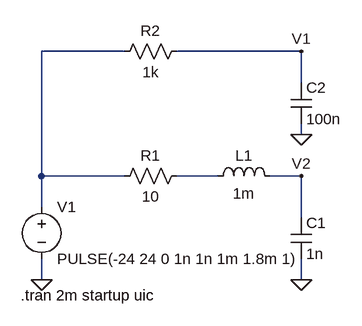
[diagram p0: schematic ex1_rc_rlc.asc]
ex1_rc_rlc.asc, the LTspice schematic file:
Version 4
SHEET 1 880 680
WIRE 80 -64 -48 -64
WIRE 352 -64 160 -64
WIRE 352 -16 352 -64
WIRE 352 64 352 48
WIRE -48 128 -48 -64
WIRE 80 128 -48 128
WIRE 224 128 160 128
WIRE 352 128 304 128
WIRE -48 176 -48 128
WIRE 352 192 352 128
WIRE -48 288 -48 256
WIRE 352 288 352 256
FLAG 352 288 0
FLAG -48 288 0
FLAG 352 64 0
FLAG 352 -64 V1
FLAG 352 128 V2
SYMBOL res 176 112 R90
WINDOW 0 0 56 VBottom 2
WINDOW 3 32 56 VTop 2
SYMATTR InstName R1
SYMATTR Value 10
SYMBOL ind 208 144 R270
WINDOW 0 32 56 VTop 2
WINDOW 3 5 56 VBottom 2
SYMATTR InstName L1
SYMATTR Value 1m
SYMBOL cap 336 192 R0
SYMATTR InstName C1
SYMATTR Value 1n
SYMBOL voltage -48 160 R0
WINDOW 123 0 0 Left 2
WINDOW 39 0 0 Left 2
SYMATTR InstName V1
SYMATTR Value PULSE(-24 24 0 1n 1n 1m 1.8m 1)
SYMBOL res 176 -80 R90
WINDOW 0 0 56 VBottom 2
WINDOW 3 32 56 VTop 2
SYMATTR InstName R2
SYMATTR Value 1k
SYMBOL cap 336 -16 R0
SYMATTR InstName C2
SYMATTR Value 100n
TEXT -80 312 Left 2 !.tran 2m startup uic

The netlist it stands for:
* ex1_rc_rlc.asc
R1 N002 N001 10
L1 N002 V2 1m
C1 V2 0 1n
V1 N001 0 PULSE(-24 24 0 1n 1n 1m 1.8m 1)
R2 V1 N001 1k
C2 V1 0 100n
.tran 2m startup uic
.backanno
.end